# Altium schematic sheet MPBoard_L5_Sens_2_ext.SchDoc
size A3; SheetNumber: 5; SheetTotal: 5
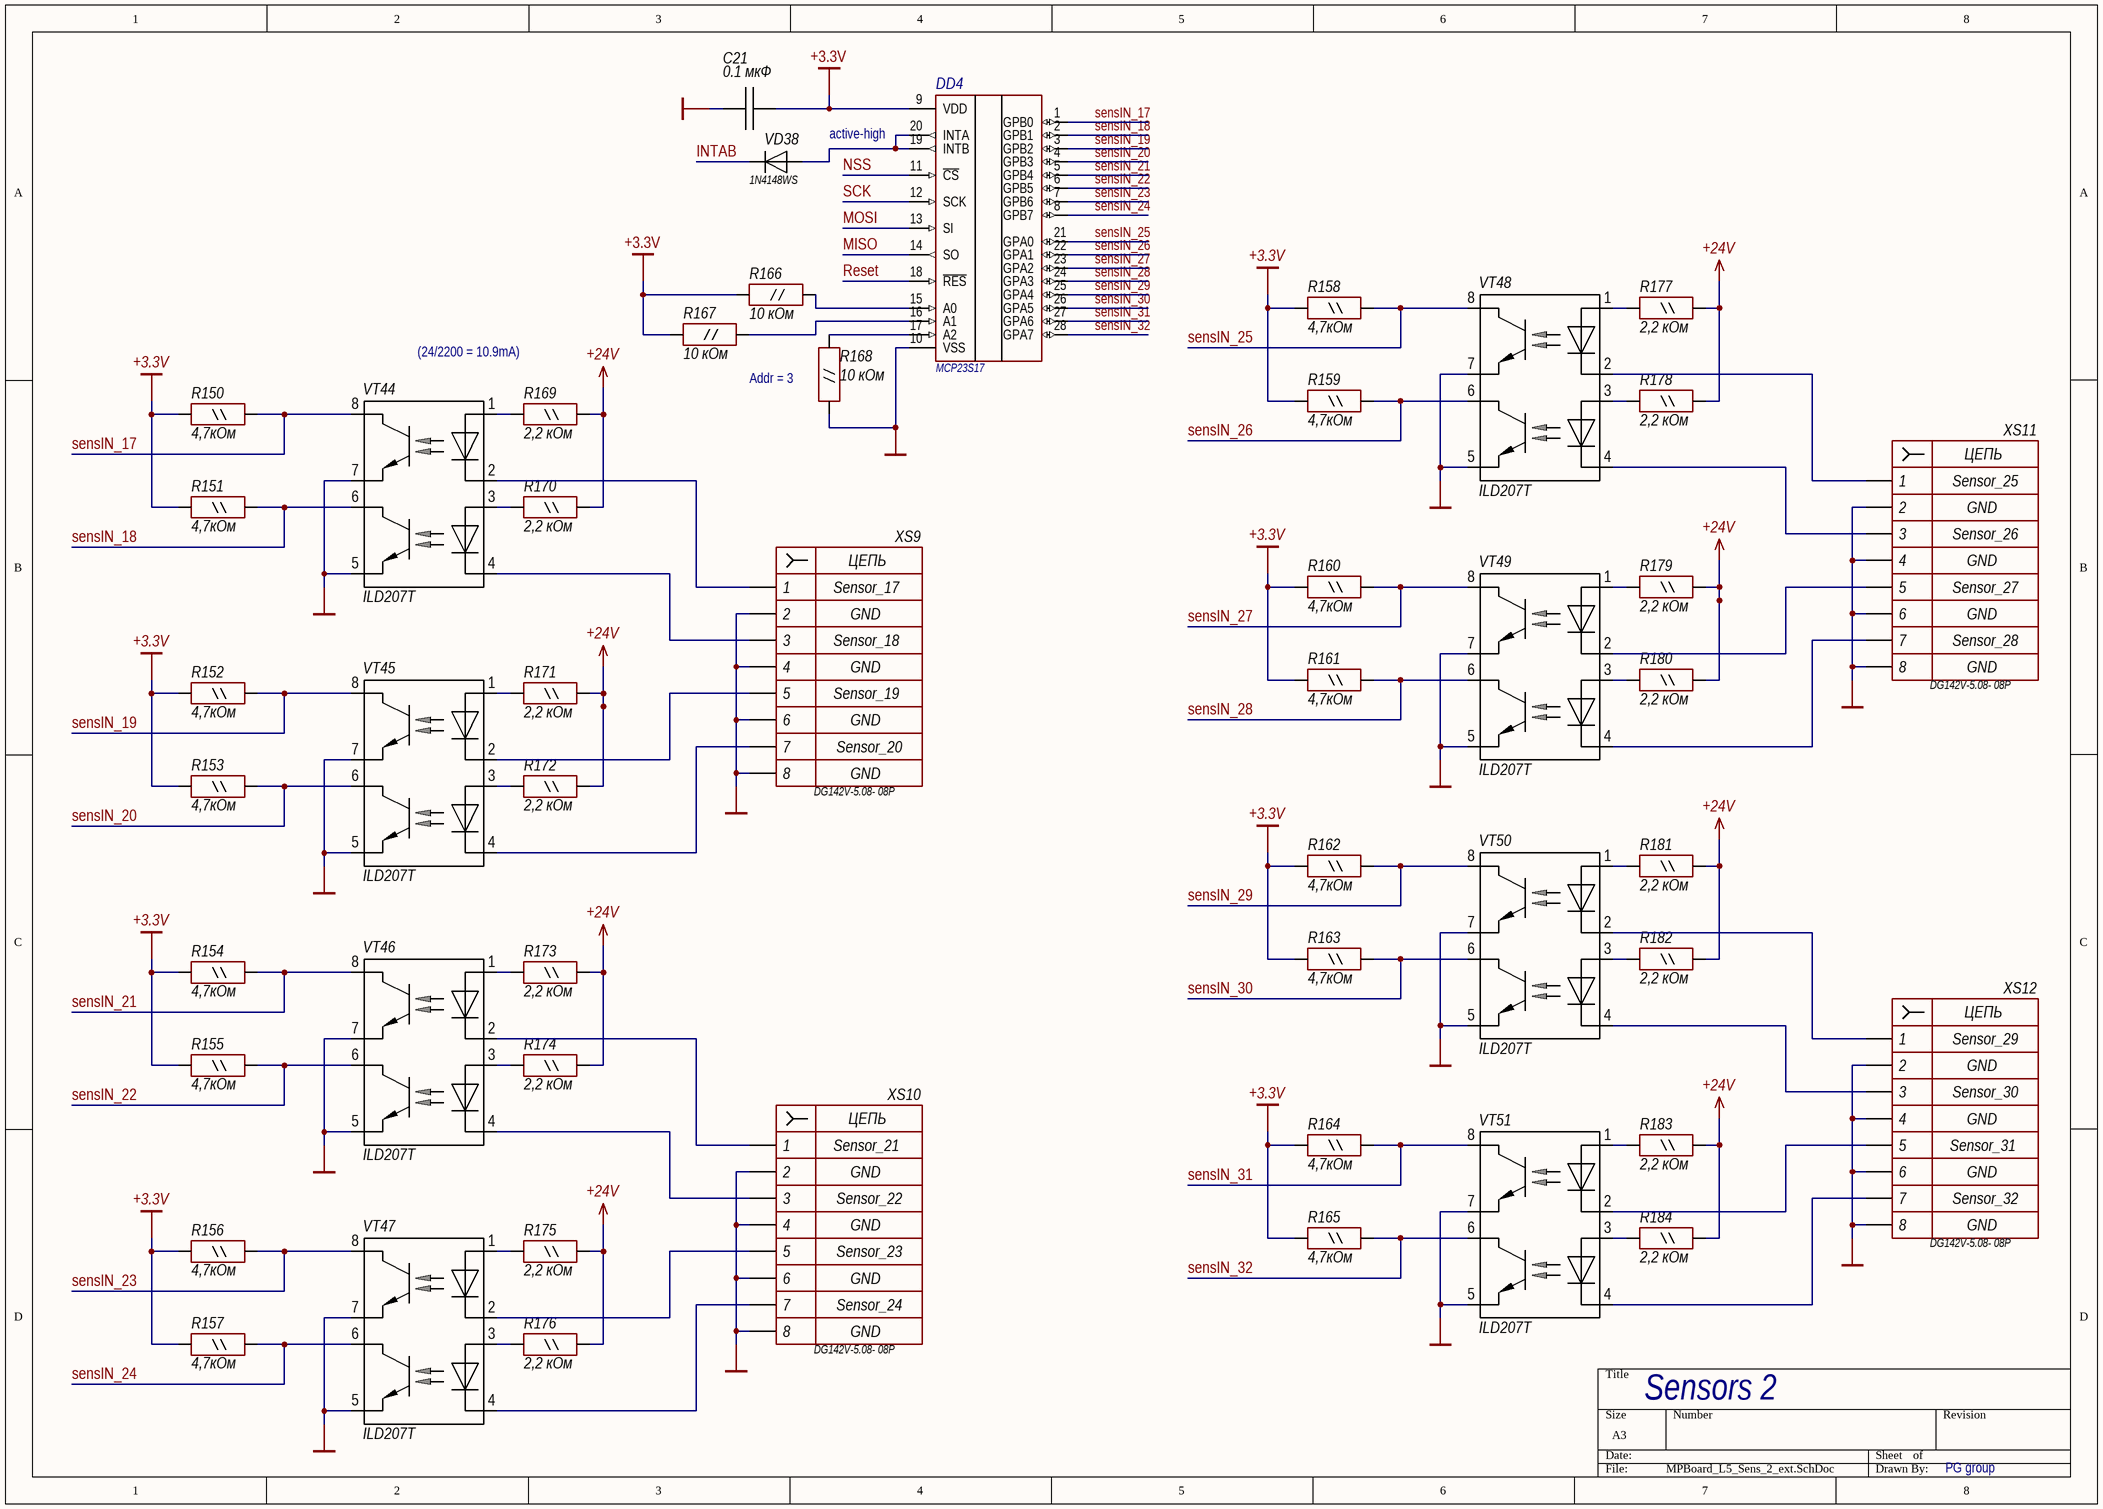
[diagram p0: MPBoard_L5_Sens_2_ext.SchDoc]

## Parts
C21  0.1 мкФ  [CAP-0603]
DD4  MCP23S17  [SOIC-28]
R150  4,7кОм  [RES-0603]
R151  4,7кОм  [RES-0603]
R152  4,7кОм  [RES-0603]
R153  4,7кОм  [RES-0603]
R154  4,7кОм  [RES-0603]
R155  4,7кОм  [RES-0603]
R156  4,7кОм  [RES-0603]
R157  4,7кОм  [RES-0603]
R158  4,7кОм  [RES-0603]
R159  4,7кОм  [RES-0603]
R160  4,7кОм  [RES-0603]
R161  4,7кОм  [RES-0603]
R162  4,7кОм  [RES-0603]
R163  4,7кОм  [RES-0603]
R164  4,7кОм  [RES-0603]
R165  4,7кОм  [RES-0603]
R166  10 кОм  [RES-0603]
R167  10 кОм  [RES-0603]
R168  10 кОм  [RES-0603]
R169  2,2 кОм  [RES-0805]
R170  2,2 кОм  [RES-0805]
R171  2,2 кОм  [RES-0805]
R172  2,2 кОм  [RES-0805]
R173  2,2 кОм  [RES-0805]
R174  2,2 кОм  [RES-0805]
R175  2,2 кОм  [RES-0805]
R176  2,2 кОм  [RES-0805]
R177  2,2 кОм  [RES-0805]
R178  2,2 кОм  [RES-0805]
R179  2,2 кОм  [RES-0805]
R180  2,2 кОм  [RES-0805]
R181  2,2 кОм  [RES-0805]
R182  2,2 кОм  [RES-0805]
R183  2,2 кОм  [RES-0805]
R184  2,2 кОм  [RES-0805]
VD38  1N4148WS  [SOD-323]
VT44  ILD207T  [SOIC-8]
VT45  ILD207T  [SOIC-8]
VT46  ILD207T  [SOIC-8]
VT47  ILD207T  [SOIC-8]
VT48  ILD207T  [SOIC-8]
VT49  ILD207T  [SOIC-8]
VT50  ILD207T  [SOIC-8]
VT51  ILD207T  [SOIC-8]
XS9  DG142V-5.08- 08P  NET6: GND  NET5: Sensor_19  NET1: Sensor_17  NET3: Sensor_18  NET7: Sensor_20  [DG142V-5.08-08]
XS10  DG142V-5.08- 08P  NET6: GND  NET5: Sensor_23  NET1: Sensor_21  NET3: Sensor_22  NET7: Sensor_24  [DG142V-5.08-08]
XS11  DG142V-5.08- 08P  NET6: GND  NET5: Sensor_27  NET1: Sensor_25  NET3: Sensor_26  NET7: Sensor_28  [DG142V-5.08-08]
XS12  DG142V-5.08- 08P  NET6: GND  NET5: Sensor_31  NET1: Sensor_29  NET3: Sensor_30  NET7: Sensor_32  [DG142V-5.08-08]

## Nets
+3.3V: C21.2 DD4.9(VDD) R150.2 R151.2 R152.2 R153.2 R154.2 R155.2 R156.2 R157.2 R158.2 R159.2 R160.2 R161.2 R162.2 R163.2 R164.2 R165.2 R166.2 R167.2
+24V: R169.1 R170.1 R171.1 R172.1 R173.1 R174.1 R175.1 R176.1 R177.1 R178.1 R179.1 R180.1 R181.1 R182.1 R183.1 R184.1
GND: C21.1 DD4.10(VSS) R168.1 VT44.5 VT44.7 VT45.5 VT45.7 VT46.5 VT46.7 VT47.5 VT47.7 VT48.5 VT48.7 VT49.5 VT49.7 VT50.5 VT50.7 VT51.5 VT51.7 XS9.2 XS9.4 XS9.6 XS9.8 XS10.2 XS10.4 XS10.6 XS10.8 XS11.2 XS11.4 XS11.6 XS11.8 XS12.2 XS12.4 XS12.6 XS12.8
INTAB: VD38.2
MISO: DD4.14(SO)
MOSI: DD4.13(SI)
NSS: DD4.11(~{CS})
Reset: DD4.18(~{RES})
SCK: DD4.12(SCK)
sensIN_17: DD4.1(GPB0) R150.1 VT44.8
sensIN_18: DD4.2(GPB1) R151.1 VT44.6
sensIN_19: DD4.3(GPB2) R152.1 VT45.8
sensIN_20: DD4.4(GPB3) R153.1 VT45.6
sensIN_21: DD4.5(GPB4) R154.1 VT46.8
sensIN_22: DD4.6(GPB5) R155.1 VT46.6
sensIN_23: DD4.7(GPB6) R156.1 VT47.8
sensIN_24: DD4.8(GPB7) R157.1 VT47.6
sensIN_25: DD4.21(GPA0) R158.1 VT48.8
sensIN_26: DD4.22(GPA1) R159.1 VT48.6
sensIN_27: DD4.23(GPA2) R160.1 VT49.8
sensIN_28: DD4.24(GPA3) R161.1 VT49.6
sensIN_29: DD4.25(GPA4) R162.1 VT50.8
sensIN_30: DD4.26(GPA5) R163.1 VT50.6
sensIN_31: DD4.27(GPA6) R164.1 VT51.8
sensIN_32: DD4.28(GPA7) R165.1 VT51.6
NetDD4_15: DD4.15(A0) R166.1
NetDD4_16: DD4.16(A1) R167.1
NetDD4_17: DD4.17(A2) R168.2
NetDD4_19: DD4.19(INTB) DD4.20(INTA) VD38.1
NetR169_2: R169.2 VT44.1
NetR170_2: R170.2 VT44.3
NetR171_2: R171.2 VT45.1
NetR172_2: R172.2 VT45.3
NetR173_2: R173.2 VT46.1
NetR174_2: R174.2 VT46.3
NetR175_2: R175.2 VT47.1
NetR176_2: R176.2 VT47.3
NetR177_2: R177.2 VT48.1
NetR178_2: R178.2 VT48.3
NetR179_2: R179.2 VT49.1
NetR180_2: R180.2 VT49.3
NetR181_2: R181.2 VT50.1
NetR182_2: R182.2 VT50.3
NetR183_2: R183.2 VT51.1
NetR184_2: R184.2 VT51.3
NetVT44_2: VT44.2 XS9.1
NetVT44_4: VT44.4 XS9.3
NetVT45_2: VT45.2 XS9.5
NetVT45_4: VT45.4 XS9.7
NetVT46_2: VT46.2 XS10.1
NetVT46_4: VT46.4 XS10.3
NetVT47_2: VT47.2 XS10.5
NetVT47_4: VT47.4 XS10.7
NetVT48_2: VT48.2 XS11.1
NetVT48_4: VT48.4 XS11.3
NetVT49_2: VT49.2 XS11.5
NetVT49_4: VT49.4 XS11.7
NetVT50_2: VT50.2 XS12.1
NetVT50_4: VT50.4 XS12.3
NetVT51_2: VT51.2 XS12.5
NetVT51_4: VT51.4 XS12.7

## Notes on the sheet
- (near DD4) active-high
- (24/2200 = 10.9mA)
- (near R168) Addr = 3
- Sensors 2
- PG group
- (in symbol XS8) ЦЕПЬ

## Library data of the parts
C21 = C: Конденсатор; MFPartNum: C0603C101K5GAC; IPSPartNumber: 65-724-19; Dielectric: X7R; MF: KEMET; Tolerance: ± 10 %; Voltage: 50 В; ValueDescription: Конденсатор 0.1 мкФ ± 10 % 50 В X7R SMD 0603; Package: SMD 0603; Value: 0.1 мкФ; HelpURL: https://content.kemet.com/datasheets/KEM_C1002_X7R_SMD.pdf; NameRUS: Конденсатор
DD4 = DD_MCP23S17: I/O Expander 16 SPI; MF: Microchip; MFPartNum: MCP23S17; Package: SOIC-28; HelpURL: https://www.chipdip.ru/product/mcp23s17-e-so
R150-R165 = R_0.125W: Резистор 0.1 W; MFPartNum: D11/CRCW0603; MF: Vishay; Tolerance: ± 1 %; ValueDescription: Резистор 4,7кОм ± 1 % SMD 0603; Package: SMD 0603; Value: 4,7кОм; HelpURL: https://www.vishay.com/docs/20035/dcrcwe3.pdf; IPSPartNumber: *; NameRUS: Резистор
R166-R168 = R_0.125W: Резистор 0.1 W; MFPartNum: D11/CRCW0603; MF: Vishay; Tolerance: ± 1 %; ValueDescription: Резистор 10 кОм ± 1 % SMD 0603; Package: SMD 0603; Value: 10 кОм; HelpURL: https://www.vishay.com/docs/20035/dcrcwe3.pdf; IPSPartNumber: *; NameRUS: Резистор
R169-R184 = R_0.125W: Резистор 0.125 W; MFPartNum: CRCW080513K3FKEA; MF: Vishay; Tolerance: ± 1 %; ValueDescription: Резистор 2,2 кОм ± 1 % SMD 0805; Package: SMD 0805; Value: 2,2 кОм; HelpURL: https://www.vishay.com/docs/20035/dcrcwe3.pdf; IPSPartNumber: *; NameRUS: Резистор
VD38 = VD: Диод Выпрямительный; MF: Diotec Semiconductor; ValueDescription: Диод выпрямительный 1N4148WS SOD-323F; MFPartNum: 1N4148WS; HelpURL: https://www.chipdip.by/product/1n4148ws-4; Value: 1N4148WS; Package: SOD-323F; NameRUS: Диод выпрямительный
VT44-VT51 = VT_2xOPTOCOUPLER: Оптопара; MF: Vishay; MFPartNum: ILD207T; Package: SOIC-8; HelpURL: https://www.chipdip.by/product/ild207-t
XS9-XS12 = XS8: розетка 8 контактов; MFPartNum: DG142V-5.08- 08P-14-00A(H); MF: Degson Electronics; ValueDescription: Разъем розетка DG142V-5.08- 08P; NameRUS: Разъем розетка; Value: DG142V-5.08- 08P; HelpURL: https://www.chipdip.by/product0/8077186472; IPSPartNumber: *; NET2: GND; NET4: GND; NET8: GND